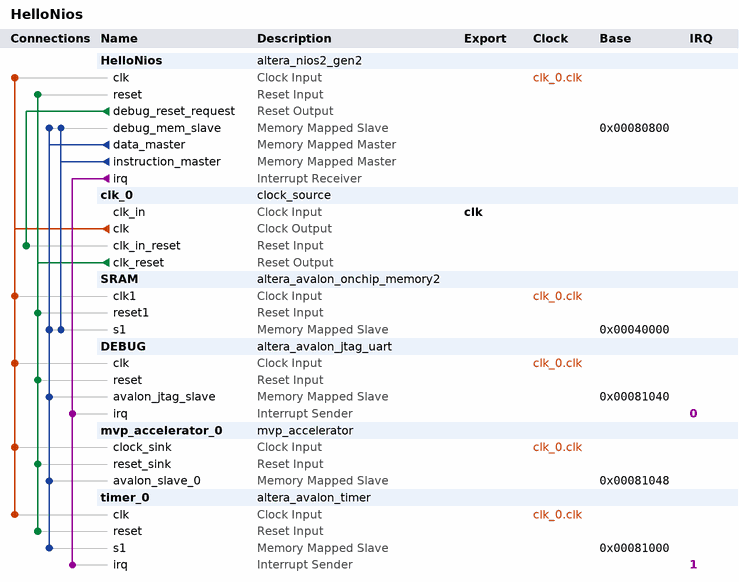
[diagram p0: system contents]
# Platform Designer (Qsys) system HelloNios, Cyclone V 5CSXFC6D6F31C6
# Parameters at their usual value, and those the tool derives, are not listed.
package require -exact qsys 18.1
create_system HelloNios
set_project_property DEVICE_FAMILY {Cyclone V}
set_project_property DEVICE 5CSXFC6D6F31C6

add_instance HelloNios altera_nios2_gen2 18.1
set_instance_parameter_value HelloNios dcache_size 2048
set_instance_parameter_value HelloNios exceptionSlave SRAM.s1
set_instance_parameter_value HelloNios icache_size 4096
set_instance_parameter_value HelloNios impl Tiny
set_instance_parameter_value HelloNios resetSlave SRAM.s1

add_instance clk_0 clock_source 18.1
set_instance_parameter_value clk_0 clockFrequency 50000000

add_instance SRAM altera_avalon_onchip_memory2 18.1
set_instance_parameter_value SRAM dataWidth 32
set_instance_parameter_value SRAM dualPort false
set_instance_parameter_value SRAM initMemContent true
set_instance_parameter_value SRAM initializationFileName onchip_mem.hex
set_instance_parameter_value SRAM memorySize 256000

add_instance DEBUG altera_avalon_jtag_uart 18.1
set_instance_parameter_value DEBUG simInteractiveOptions NO_INTERACTIVE_WINDOWS

add_instance mvp_accelerator_0 mvp_accelerator 1.0

add_instance timer_0 altera_avalon_timer 18.1
set_instance_parameter_value timer_0 counterSize 64
set_instance_parameter_value timer_0 period 100000000
set_instance_parameter_value timer_0 periodUnits CLOCKS

# connections
add_connection clk_0.clk DEBUG.clk clock
add_connection clk_0.clk HelloNios.clk clock
add_connection clk_0.clk mvp_accelerator_0.clock_sink clock
add_connection clk_0.clk SRAM.clk1 clock
add_connection clk_0.clk timer_0.clk clock
add_connection clk_0.clk_reset DEBUG.reset reset
add_connection clk_0.clk_reset HelloNios.reset reset
add_connection clk_0.clk_reset mvp_accelerator_0.reset_sink reset
add_connection clk_0.clk_reset SRAM.reset1 reset
add_connection clk_0.clk_reset timer_0.reset reset
add_connection HelloNios.debug_reset_request clk_0.clk_in_reset reset
add_connection HelloNios.data_master DEBUG.avalon_jtag_slave avalon
set_connection_parameter_value HelloNios.data_master/DEBUG.avalon_jtag_slave baseAddress 0x00081040
add_connection HelloNios.data_master HelloNios.debug_mem_slave avalon
set_connection_parameter_value HelloNios.data_master/HelloNios.debug_mem_slave baseAddress 0x00080800
add_connection HelloNios.data_master mvp_accelerator_0.avalon_slave_0 avalon
set_connection_parameter_value HelloNios.data_master/mvp_accelerator_0.avalon_slave_0 baseAddress 0x00081048
add_connection HelloNios.data_master SRAM.s1 avalon
set_connection_parameter_value HelloNios.data_master/SRAM.s1 baseAddress 0x00040000
add_connection HelloNios.data_master timer_0.s1 avalon
set_connection_parameter_value HelloNios.data_master/timer_0.s1 baseAddress 0x00081000
add_connection HelloNios.instruction_master HelloNios.debug_mem_slave avalon
set_connection_parameter_value HelloNios.instruction_master/HelloNios.debug_mem_slave baseAddress 0x00080800
add_connection HelloNios.instruction_master SRAM.s1 avalon
set_connection_parameter_value HelloNios.instruction_master/SRAM.s1 baseAddress 0x00040000
add_connection HelloNios.irq DEBUG.irq interrupt
set_connection_parameter_value HelloNios.irq/DEBUG.irq irqNumber 0
add_connection HelloNios.irq timer_0.irq interrupt
set_connection_parameter_value HelloNios.irq/timer_0.irq irqNumber 1

# exported interfaces
add_interface clk clock sink
set_interface_property clk EXPORT_OF clk_0.clk_in

set_interconnect_requirement {$system} qsys_mm.clockCrossingAdapter HANDSHAKE
set_interconnect_requirement {$system} qsys_mm.enableEccProtection FALSE
set_interconnect_requirement {$system} qsys_mm.insertDefaultSlave FALSE
set_interconnect_requirement {$system} qsys_mm.maxAdditionalLatency 1

save_system HelloNios.qsys
